# EAGLE design projek robot 1 fix (EAGLE 8.6.3)
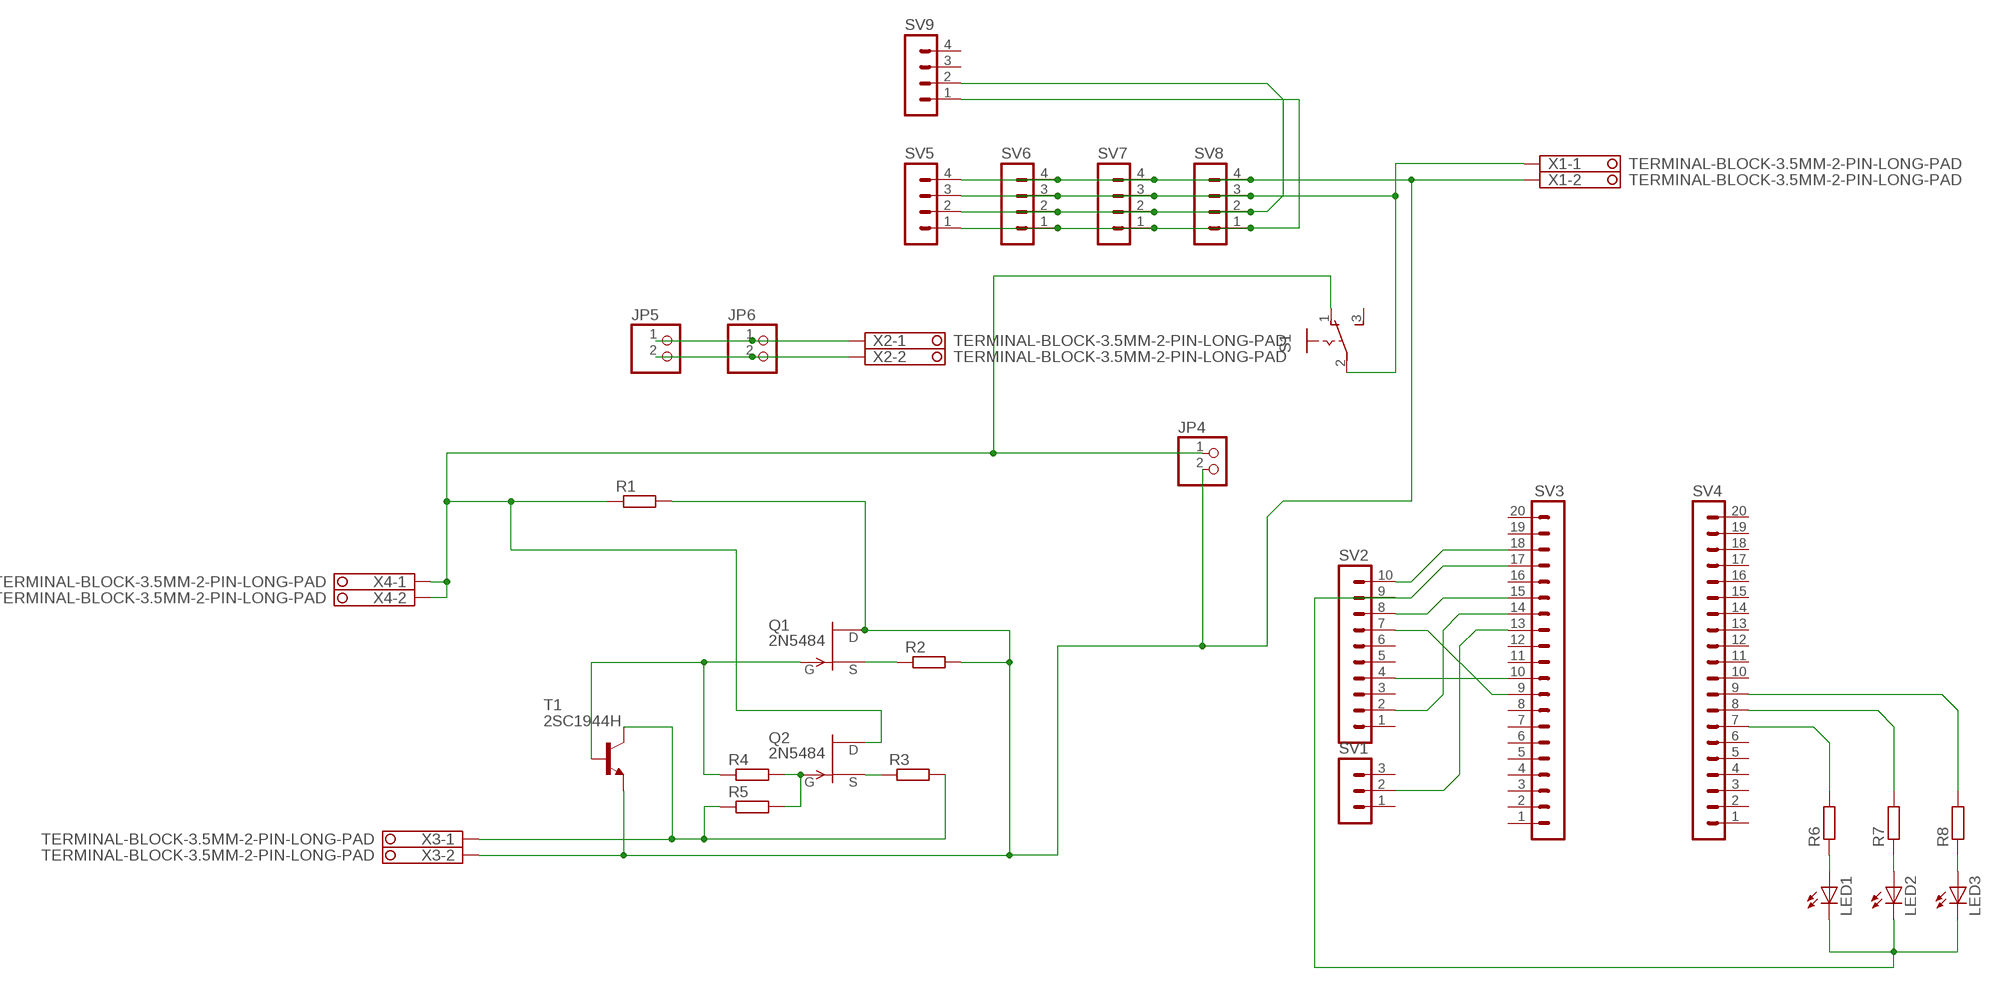
[diagram p0: schematic, sheet 1]

## Parts
JP4  PINHD-1X2  [1X02]
JP5  PINHD-1X2  [1X02]
JP6  PINHD-1X2  [1X02]
LED1  LED5MM  [LED5MM]
LED2  LED5MM  [LED5MM]
LED3  LED5MM  [LED5MM]
Q1  2N5484  [TO92-]
Q2  2N5484  [TO92-]
R1  R-EU_0207/7  [0207/7]
R2  R-EU_0207/7  [0207/7]
R3  R-EU_0207/7  [0207/7]
R4  R-EU_0207/7  [0207/7]
R5  R-EU_0207/7  [0207/7]
R6  R-EU_0207/7  [0207/7]
R7  R-EU_0207/7  [0207/7]
R8  R-EU_0207/7  [0207/7]
S1  M251  [M251]
SV1  MA03-1  [MA03-1]
SV2  MA10-1  [MA10-1]
SV3  MA20-1  [MA20-1]
SV4  MA20-1  [MA20-1]
SV5  MA04-1  [MA04-1]
SV6  MA04-1  [MA04-1]
SV7  MA04-1  [MA04-1]
SV8  MA04-1  [MA04-1]
SV9  MA04-1  [MA04-1]
T1  2SC1944H  [T-30]
X1  TERMINAL-BLOCK-3.5MM-2-PIN-LONG-PAD  [TERMINAL-BLOCK-2-PIN-3.5MM-LONG-PAD]
X2  TERMINAL-BLOCK-3.5MM-2-PIN-LONG-PAD  [TERMINAL-BLOCK-2-PIN-3.5MM-LONG-PAD]
X3  TERMINAL-BLOCK-3.5MM-2-PIN-LONG-PAD  [TERMINAL-BLOCK-2-PIN-3.5MM-LONG-PAD]
X4  TERMINAL-BLOCK-3.5MM-2-PIN-LONG-PAD  [TERMINAL-BLOCK-2-PIN-3.5MM-LONG-PAD]

## Nets
N$1: Q2.2(S) R3.1
N$2: Q1.2(S) R2.1
N$3: Q2.1(G) R4.2 R5.2
N$4: Q1.1(G) R4.1 T1.1(B)
N$5: JP5.1 JP6.1 X2.1
N$6: R3.2 R5.1 T1.2(C) X3.1
N$7: JP4.1 Q2.3(D) R1.1 S1.1(O) X4.1 X4.2
N$8: SV2.10 SV3.18
N$10: SV2.8 SV3.15
N$11: SV2.7 SV3.9
N$12: SV2.2 SV3.14
N$13: SV2.4 SV3.10
N$14: SV1.2 SV3.13
N$15: LED1.A R6.1
N$16: LED2.A R7.1
N$17: LED3.A R8.1
N$18: R6.2 SV4.7
N$19: R7.2 SV4.8
N$20: R8.2 SV4.9
N$21: JP4.2 Q1.3(D) R1.2 R2.2 SV5.4 SV6.4 SV7.4 SV8.4 T1.3(E) X1.2 X3.2
N$22: S1.2(P) SV5.3 SV6.3 SV7.3 SV8.3 X1.1
N$23: SV5.2 SV6.2 SV7.2 SV8.2 SV9.2
N$24: JP5.2 JP6.2 X2.2
N$26: SV5.1 SV6.1 SV7.1 SV8.1 SV9.1
N$31: LED1.K(C) LED2.K(C) LED3.K(C) SV2.9 SV3.17
Unconnected: S1.3(S) SV1.1 SV1.3 SV2.1 SV2.3 SV2.5 SV2.6 SV3.1 SV3.2 SV3.3 SV3.4 SV3.5 SV3.6 SV3.7 SV3.8 SV3.11 SV3.12 SV3.16 SV3.19 SV3.20 SV4.1 SV4.2 SV4.3 SV4.4 SV4.5 SV4.6 SV4.10 SV4.11 SV4.12 SV4.13 SV4.14 SV4.15 SV4.16 SV4.17 SV4.18 SV4.19 SV4.20 SV9.3 SV9.4

## Library data of the parts
JP4-JP6 = pinhead:PINHD-1X2: PIN HEADER
LED1-LED3 = adafruit:LED: LED OSRAM: - CHIPLED LG R971, LG N971, LY N971, LG Q971, LY Q971, LO R971, LY R971 LH N974, LH R974 LS Q976, LO Q976, LY Q976 LO Q996 - Hyper CHIPLED LW Q18S LB Q993, LB Q99A, LB R99A - SideLED LS A670, LO A670, LY A670, LG A670, LP A670 LB A673, LV A673, LT A673, LW A673 LH A674 LY A675 LS A676, LA A676, LO A676, LY A676, LW A676 LS A679, LY A679, LG A679 - Hyper Micro SIDELED® LS Y876, LA Y876, LO Y876, LY Y876 LT Y87S - SmartLED LW L88C, LW L88S LB L89C, LB L89S, LG L890 LS L89K, LO L89K, LY L89K LS L896, LA L896, LO L896, LY L896 - TOPLED LS T670, LO T670, LY T670, LG T670, LP T670 LSG T670, LSP T670, LSY T670, LOP T670, LYG T670 LG T671, LOG T671, LSG T671 LB T673, LV T673, LT T673, LW T673 LH T674 LS T676, LA T676, LO T676, LY T676, LB T676, LH T676, LSB T676, LW T676 LB T67C, LV T67C, LT T67C, LS T67K, LO T67K, LY T67K, LW E67C LS E67B, LA E67B, LO E67B, LY E67B, LB E67C, LV E67C, LT E67C LW T67C LS T679, LY T679, LG T679 LS T770, LO T770, LY T770, LG T770, LP T770 LB T773, LV T773, LT T773, LW T773 LH T774 LS E675, LA E675, LY E675, LS T675 LS T776, LA T776, LO T776, LY T776, LB T776 LHGB T686 LT T68C, LB T68C - Hyper Mini TOPLED® LB M676 - Mini TOPLED Santana® LG M470 LS M47K, LO M47K, LY M47K Source: http://www.osram.convergy.de/
Q1 Q2 = transistor-fet:?548*: N-Channel JFETs Source: VISHAY 2N5484.pdf Compatible: TO92 2N5245 J304 J305 U310 J308 J309 J310 TO72 2N4416 2N4416A 2N3823 2N4351 3N169 3N170 3N171 MFE3002 TO18 2N3796 2N3797 MFE825 Source: Motorola European Master Guide Pacge 3-59
R1-R8 = rcl:R-EU_: RESISTOR, European symbol; SPICEPREFIX: R
S1 = switch:M251: SLIDING SWITCH Mors, distributor Buerklin, 11G702
SV1 = con-lstb:MA03-1: PIN HEADER; OC_FARNELL: unknown; OC_NEWARK: unknown
SV2 = con-lstb:MA10-1: PIN HEADER; OC_FARNELL: unknown; OC_NEWARK: unknown
SV3 SV4 = con-lstb:MA20-1: PIN HEADER; OC_FARNELL: unknown; OC_NEWARK: unknown
SV5-SV9 = con-lstb:MA04-1: PIN HEADER; OC_FARNELL: unknown; OC_NEWARK: unknown
T1 = transistor:2SC1944: NPN Epitaxial Planar Transistor RF Power Amplifier Source: 2SC1944.pdf
X1-X4 = Rembrandt Electronics - Terminal Block 3-5mm v1-0:TERMINAL-BLOCK-3.5MM-2-PIN: Terminal Block 3.5mm Pitch: 3,5 mm Number of pins: 2 Created by Rembrandt Electronics www.rembrandtelectronics.com

## Board
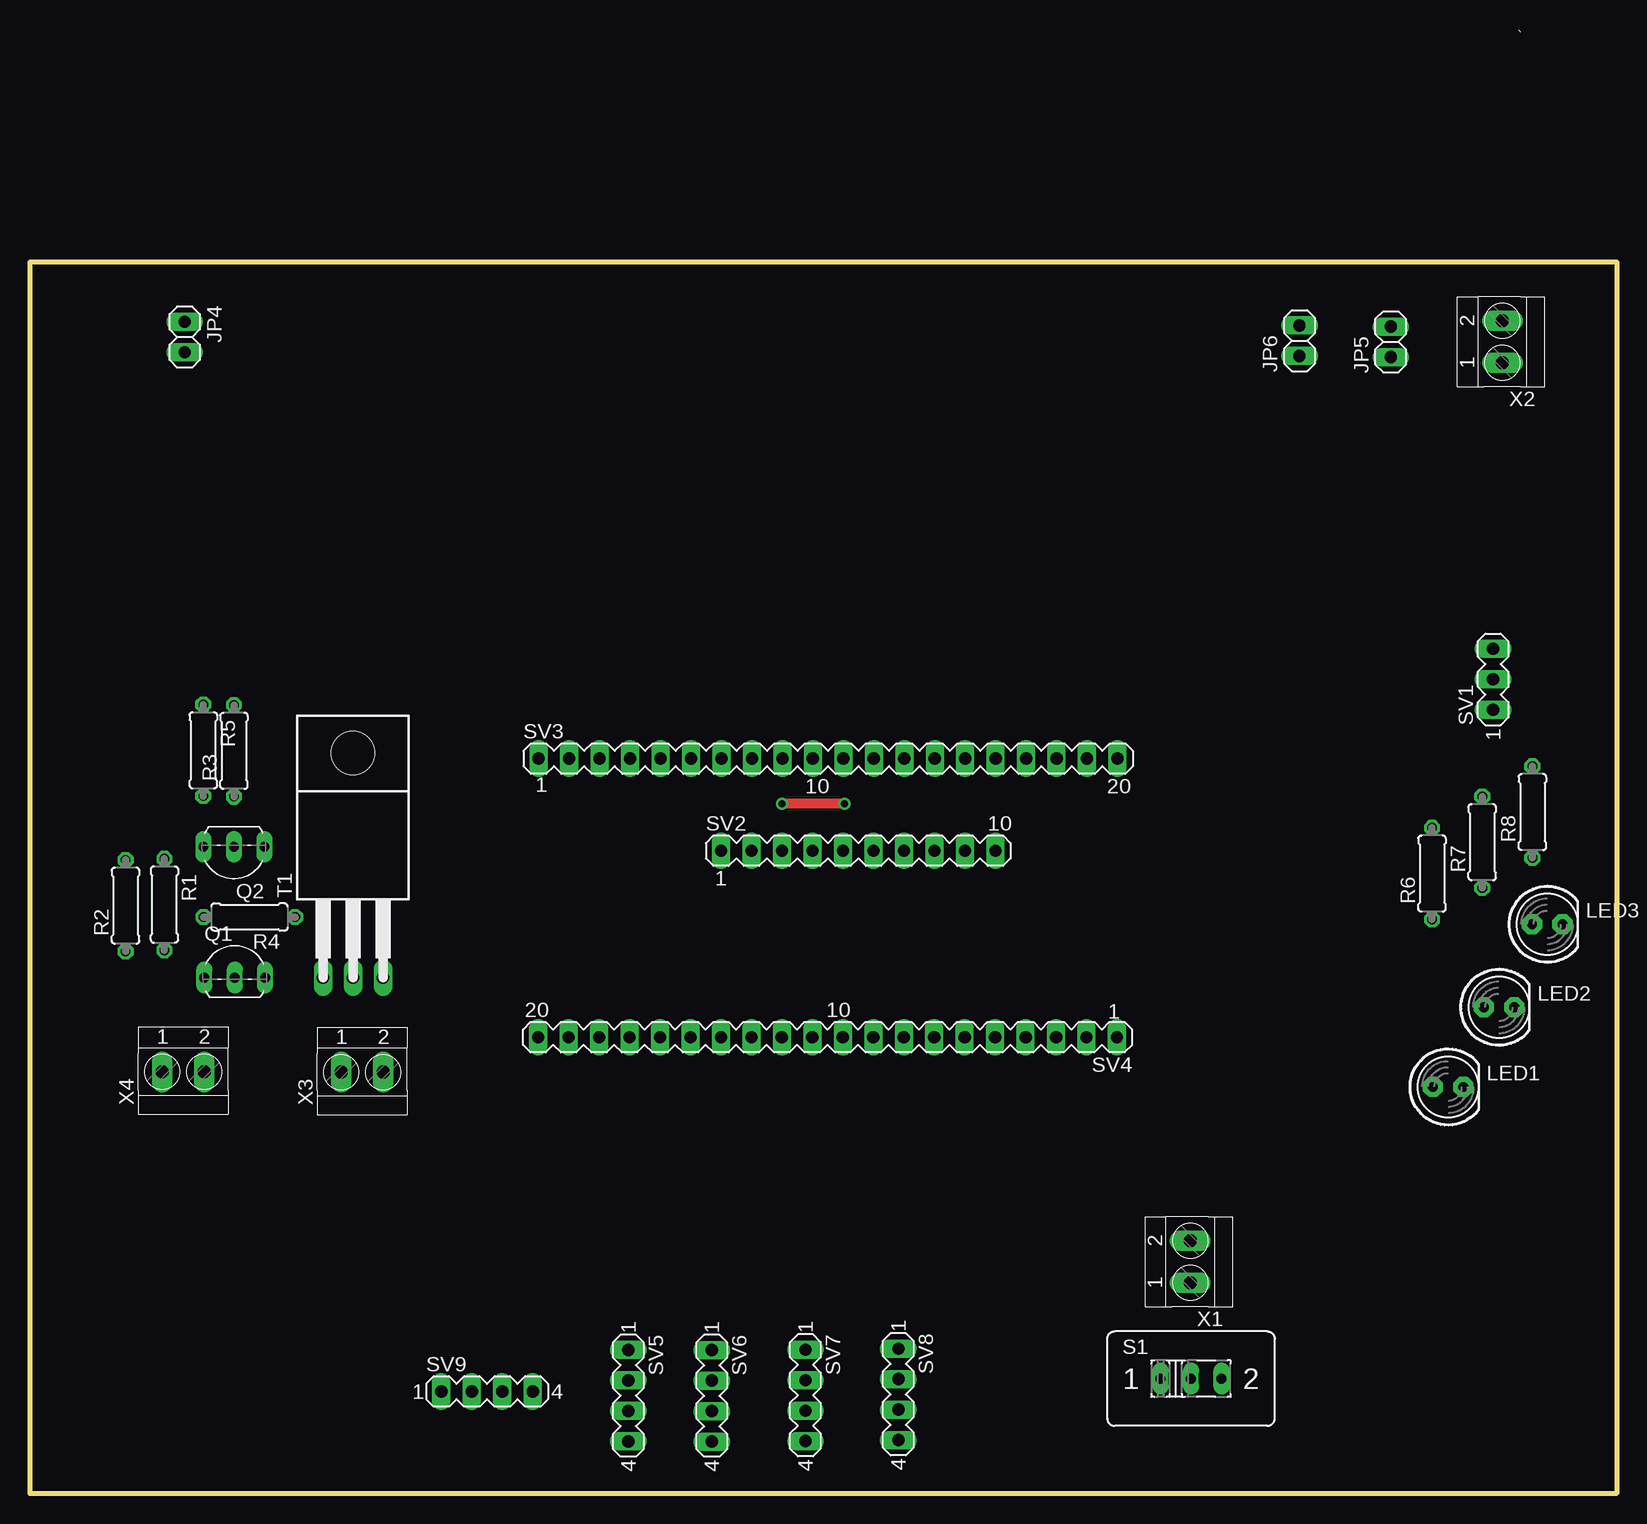
[diagram p1: board, top side]
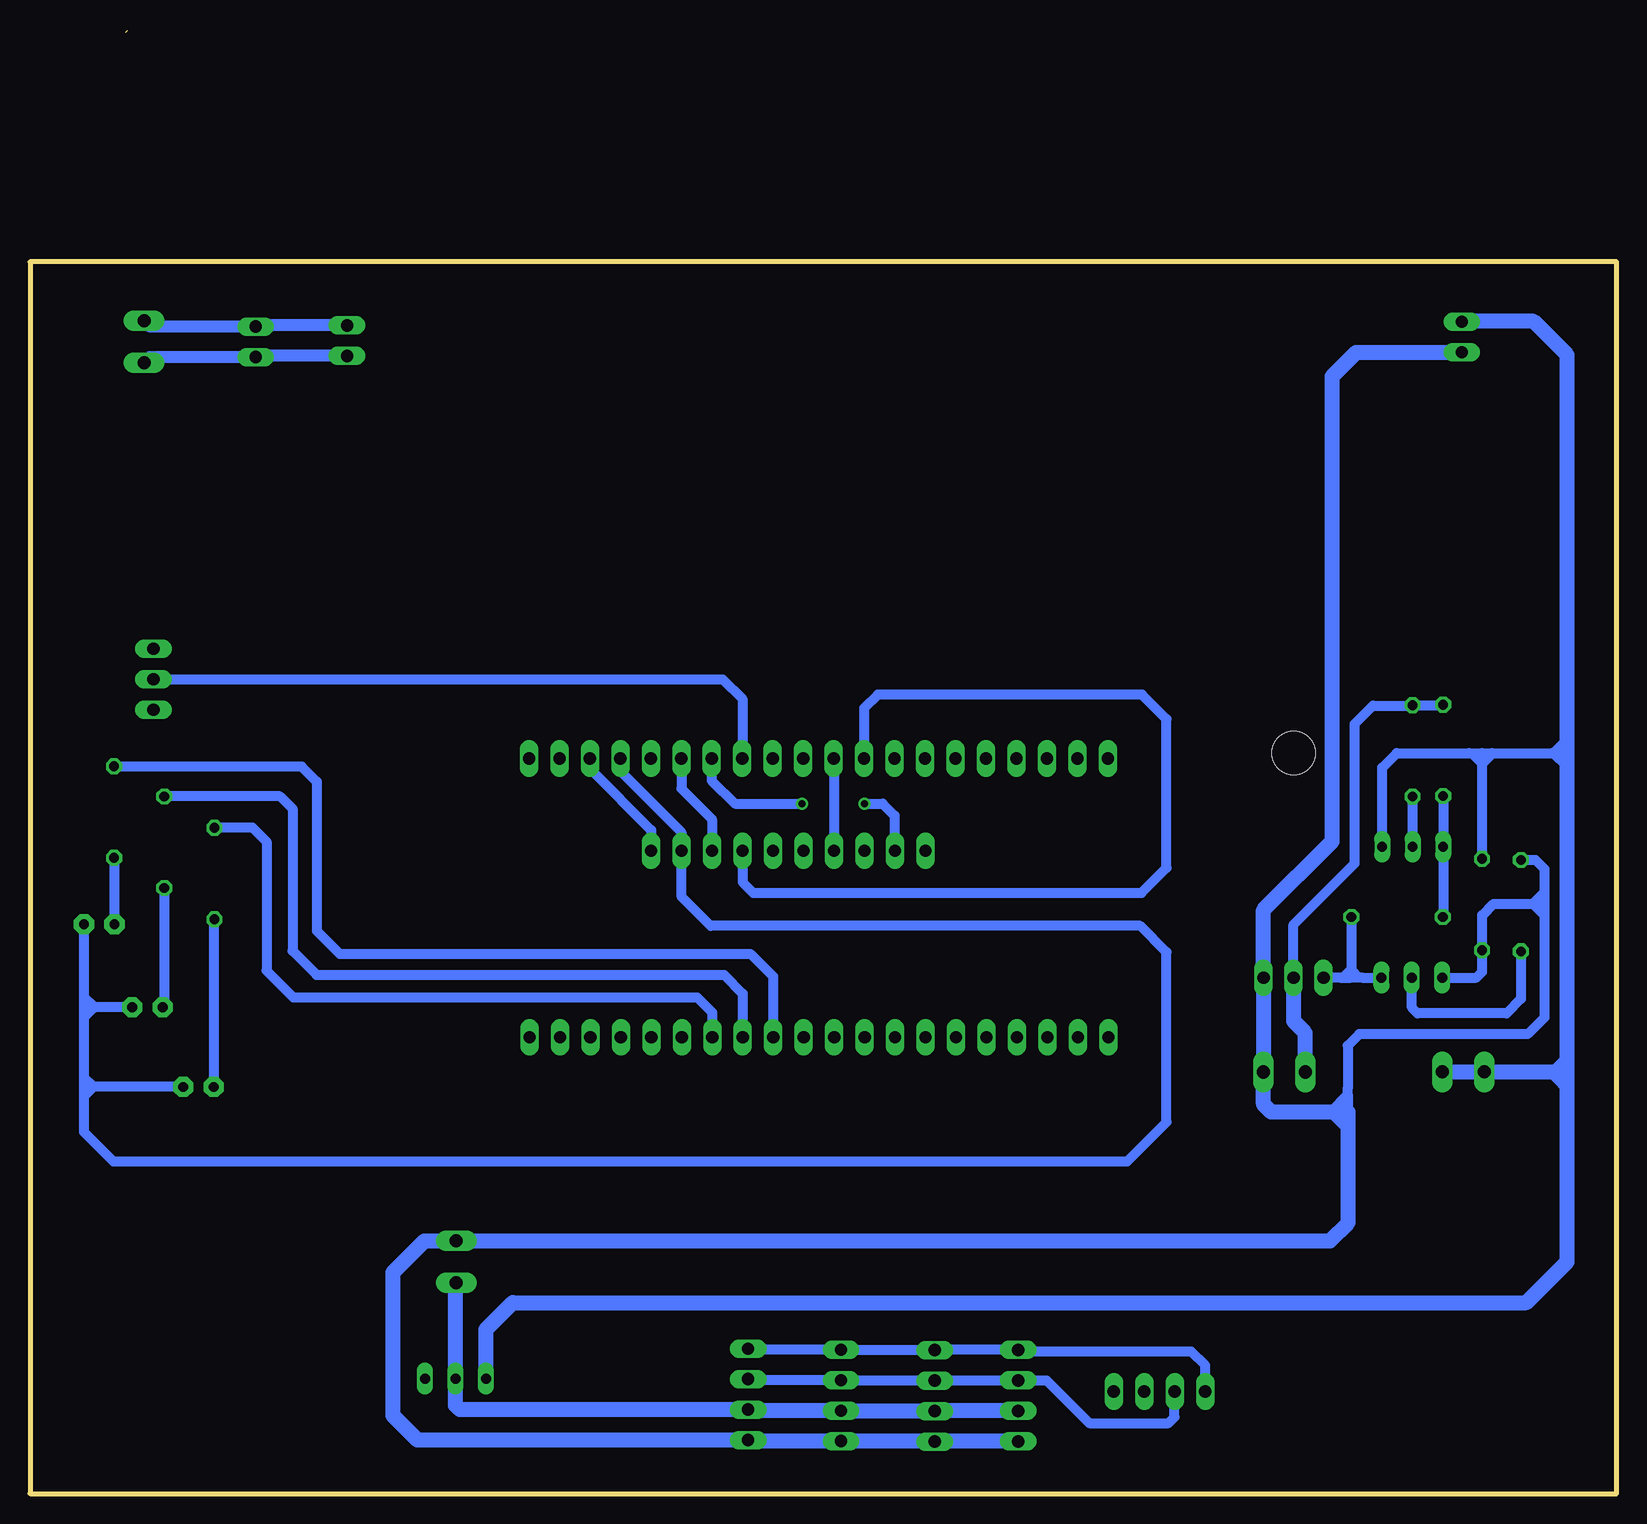
[diagram p2: board, bottom side, seen from below]

Size 132.25 x 121.97 mm. Coordinates in mm from the lower left corner, seen from the top.
Outline: 124.28,121.79 124.09,121.97
Outline: 0,102.65 132.25,102.65 132.25,0 0,0 0,102.65
Copper layers (1*16): Top 0.035mm / dielectric 1.5mm / Bottom 0.035mm
Design rules "default": minimum track width 6mil, minimum drill 0.35mm, track to track 6mil, track to pad 6mil, pad to pad 6mil, via to via 6mil, smd to smd 6mil, copper to edge 40mil, drill to drill 6mil, minimum pad ring 10mil, minimum via ring 8mil, stop-mask expansion 4mil, vias tented up to drill 0mil, thermal gap 10mil

### Footprints (pad centres in the part's own frame; a part is rotated, then mirrored left to right if it is on the bottom)
1X02 = drill 1.016 long: 1 -1.27,0; 2 1.27,0
LED5MM = drill 0.813 pad 1.676 octagon: A -1.27,0; K 1.27,0
TO92- = drill 0.813 long: 1 2.54,0; 2 0,0; 3 -2.54,0
0207/7 = drill 0.813 octagon: 1 -3.81,0; 2 3.81,0
M251 = drill 0.813 long: 1 -2.54,0; 2 0,0; 3 2.54,0
MA03-1 = drill 1.016 long: 1 -2.54,0; 2 0,0; 3 2.54,0
MA10-1 = drill 1.016 long: 1 -11.43,0; 2 -8.89,0; 3 -6.35,0; 4 -3.81,0; 5 -1.27,0; 6 1.27,0; 7 3.81,0; 8 6.35,0; 9 8.89,0; 10 11.43,0
MA20-1 = drill 1.016 long: 1 -24.13,0; 2 -21.59,0; 3 -19.05,0; 4 -16.51,0; 5 -13.97,0; 6 -11.43,0; 7 -8.89,0; 8 -6.35,0; 9 -3.81,0; 10 -1.27,0; 11 1.27,0; 12 3.81,0; 13 6.35,0; 14 8.89,0; 15 11.43,0; 16 13.97,0; 17 16.51,0; 18 19.05,0; 19 21.59,0; 20 24.13,0
MA04-1 = drill 1.016 long: 1 -3.81,0; 2 -1.27,0; 3 1.27,0; 4 3.81,0
T-30 = drill 1.016 long: 1 -2.5,-18.735; 2 0,-18.735; 3 2.5,-18.735 | hole 3.6: 0,0
TERMINAL-BLOCK-2-PIN-3.5MM-LONG-PAD = drill 1.1 pad 1.7 long: 1 -1.75,-0.1; 2 1.75,-0.1

### Placement (x,y rotation side)
JP4  12.9,96.38 270 top
JP5  113.43,95.98 90 top
JP6  105.82,96.08 90 top
LED1  118.21,33.89 0 top
LED2  122.45,40.53 0 top
LED3  126.48,47.45 0 top
Q1  17.06,43 0 top
Q2  16.99,53.91 180 top
R1  11.21,49.09 270 top
R2  7.97,48.99 90 top
R3  17,61.89 90 top
R4  18.29,48.05 180 top
R5  14.45,61.94 270 top
R6  116.87,51.67 90 top
R7  121.06,54.28 90 top
R8  125.24,56.79 90 top
S1  96.78,9.58 0 top
SV1  121.96,67.85 90 top
SV2  69.04,53.58 0 top
SV3  66.53,61.25 0 top
SV4  66.48,38.04 180 top
SV5  49.88,8.16 270 top
SV6  56.83,8.15 270 top
SV7  64.64,8.19 270 top
SV8  72.38,8.27 270 top
SV9  38.1,8.51 0 top
T1  26.92,61.72 0 top
X1  96.62,19.31 90 top
X2  122.64,95.98 90 top
X3  27.69,35.23 0 top
X4  12.77,35.25 0 top

### Tracks (layer width: path | path; a pad name or v marks a point on that pad's centre or on a via)
N$1
  Bottom 0.813: R3.1 17,53.92 Q2.2
N$2
  Bottom 0.813: R2.1 7.97,41.22 9.16,40.03 16.6,40.03 17.06,40.49 Q1.2
N$3
  Bottom 0.813: R5.2 Q2.1 14.45,48.07 R4.2
N$4
  Bottom 0.406: 21.21,43 22.1,43.89 22.16,43.89 23.05,43
  Bottom 0.813: 22.15,43 21.21,43 Q1.1 | 22.15,43 23.05,43 T1.1 | R4.1 22.1,43.89 22.1,43.05 22.15,43
N$5
  Bottom 0.813: 113.34,94.8 JP5.1 | 122.26,94.71 X2.1
  Bottom 1.016: JP6.1 113.34,94.8 | JP5.1 122.26,94.71
N$6
  Bottom 0.813: R5.1 14.49,65.7 R3.2 17.04,65.67 20.3,65.67 21.82,64.15 21.82,52.51 26.92,47.41 T1.2 26.91,42.97
  Bottom 1.27: X3.1 25.94,38.4 26.91,39.37 26.91,42.97
N$7
  Bottom 0.61: 12.3,61.71 12.21,61.71 11.21,60.71 10.37,61.55 10.37,61.71 | 4.11,60.47 4.14,60.47 5.38,61.71 4.3,62.79 4.11,62.79
  Bottom 0.813: 10.92,35.25 X4.1 | Q2.3 19.53,60.5 18.32,61.71 12.3,61.71 11.21,61.71 | 11.21,61.71 10.37,61.71 5.38,61.71 4.13,61.71 4.11,61.73 | R1.1 11.21,60.71 11.21,61.71
  Bottom 1.016: 4.11,34.11 4.42,34.11 5.45,35.15 5.23,35.15 4.11,36.27
  Bottom 1.27: S1.1 94.24,13.69 92.02,15.91 7.51,15.91 4.11,19.31 4.11,34.11 4.11,35.06 | 4.11,35.06 4.11,36.27 4.11,60.47 4.11,61.73 4.11,62.79 4.11,94.89 6.91,97.69 12.86,97.69 JP4.1 | X4.2 X4.1 5.45,35.15 4.2,35.15 4.11,35.06
N$8
  Bottom 0.813: SV3.18 85.58,60.4 80.47,55.29 SV2.10
N$10
  Bottom 0.813: SV3.15 77.96,58.76 75.4,56.2 SV2.8
N$11
  Bottom 0.813: SV2.7 72.85,50.95 71.96,50.06 39.59,50.06 37.5,52.15 37.5,64.54 39.55,66.59 61.58,66.59 62.71,65.46 62.71,61.26 SV3.9
N$12  (via drill 0.6)
  Top 0.813: v67.89,57.49 v62.68,57.49
  Bottom 0.813: SV3.14 75.42,59.42 73.49,57.49 v67.89,57.49 | v62.68,57.49 61.18,57.49 60.18,56.49 60.18,53.61 SV2.2
N$13
  Bottom 0.813: SV3.10 65.23,61.25 SV2.4
N$14
  Bottom 0.813: SV1.2 74.5,67.85 72.87,66.22 SV3.13
N$15
  Bottom 0.813: R6.1 116.94,47.86 LED1.A
N$16
  Bottom 0.813: R7.1 121.06,40.66 LED2.A
N$17
  Bottom 0.813: R8.1 125.24,47.48 LED3.A
N$18
  Bottom 0.813: R6.2 113.69,55.49 112.53,54.33 112.53,43.59 110.3,41.36 76.64,41.36 75.39,40.11 75.39,38.05 SV4.7
N$19
  Bottom 0.813: R7.2 121.05,58.1 111.4,58.1 110.37,57.07 110.37,45.22 108.37,43.22 74.39,43.22 72.84,41.67 SV4.8
N$20
  Bottom 0.813: R8.2 125.22,60.58 109.59,60.58 108.34,59.33 108.34,46.9 106.42,44.98 72.19,44.98 70.31,43.1 70.31,38.05 SV4.9
N$21
  Bottom 0.813: 29.5,43.07 T1.3 | Q1.3 11.68,43 11.2,43.48 R1.2 11.21,48.21 10.27,49.15 6.97,49.15 | 29.42,35.15 X3.2 | JP4.2 | R2.2 6.75,52.8 6.02,52.07 6.02,50.1 | 6.02,50.1 6.02,49.11 | 6.02,49.11 6.02,48.2 | 6.02,48.2 6.02,39.67 7.4,38.29 21.45,38.29 22.41,37.33 22.41,33.75 22.41,33.26 | 22.41,33.26 22.41,31.84 22.37,31.8 | 6.97,49.15 6.06,49.15 6.02,49.11 | 6.97,49.15 6.02,48.2 | 6.97,49.15 6.02,50.1 | 22.37,29.81 22.37,30.3 23.87,31.8 22.41,33.26
  Bottom 1.27: JP4.2 21.7,95.11 23.7,93.11 23.7,54.36 29.42,48.64 T1.3 29.42,35.15 29.42,32.44 28.78,31.8 23.87,31.8 22.37,31.8 22.37,29.81 22.37,22.58 23.88,21.06 X1.2 99.37,21.06 101.99,18.45 101.99,6.51 99.95,4.46 SV8.4 72.3,4.38 SV7.4 56.86,4.38 SV6.4 56.82,4.35 SV5.4
N$22
  Bottom 0.813: 96.78,17.51 X1.1
  Bottom 1.27: 96.78,17.51 S1.2 96.78,7.35 96.43,7 SV8.3 72.3,6.92 SV7.3 64.6,6.88 SV6.3 56.82,6.89 SV5.3
N$23
  Bottom 0.813: SV8.2 72.3,9.46 SV7.2 64.6,9.42 SV6.2 56.82,9.43 SV5.2 47.51,9.43 43.95,5.87 37.35,5.87 36.84,6.38 SV9.2
N$24
  Bottom 0.813: 113.86,97.34 113.95,97.25 JP5.2 | 122.26,97.25 X2.2
  Bottom 1.016: JP6.2 113.86,97.34 | JP5.2 122.26,97.25
N$26
  Bottom 0.813: SV8.1 72.3,12 SV7.1 64.6,11.96 SV6.1 56.82,11.97 SV5.1 49.75,11.84 35.44,11.84 34.29,10.69 SV9.1
N$31
  Bottom 0.813: SV3.17 83.04,60.19 77.95,55.1 77.95,53.6 SV2.9 77.92,53.57 77.92,49.72 75.51,47.31 39.7,47.31 37.52,45.13 37.52,30.96 40.79,27.69 125.3,27.69 127.75,30.14 127.75,33.08 | LED3.K 127.75,41.41 | 127.75,41.41 127.75,40.59 | 127.75,40.59 127.75,39.67 | 127.75,39.67 127.75,34.69 | 127.75,34.69 127.75,34 | 127.75,34 127.75,33.08 | LED2.K 126.83,40.53 126.87,40.53 | 126.87,40.53 127.69,40.53 127.75,40.59 | LED1.K 126.94,33.89 | 126.95,33.89 127.64,33.89 127.75,34 | 126.94,33.89 126.95,33.89 | 126.95,33.89 127.75,34.69 | 126.94,33.89 127.75,33.08 | 126.87,40.53 127.75,41.41 | 126.87,40.53 126.89,40.53 127.75,39.67